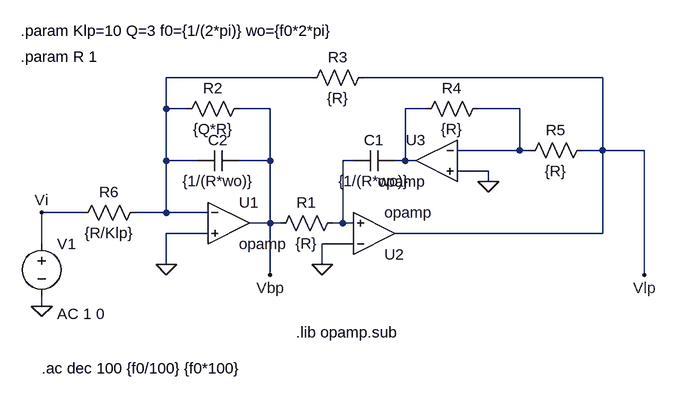
[diagram p0: schematic ts2.asc]
ts2.asc, the LTspice schematic file:
Version 4
SHEET 1 880 680
WIRE 176 96 -48 96
WIRE 624 96 256 96
WIRE -48 144 -48 96
WIRE -16 144 -48 144
WIRE 112 144 64 144
WIRE 352 144 320 144
WIRE 496 144 432 144
WIRE 496 208 496 144
WIRE 496 208 400 208
WIRE 512 208 496 208
WIRE 624 208 624 96
WIRE 624 208 592 208
WIRE 688 208 624 208
WIRE -48 224 -48 144
WIRE 0 224 -48 224
WIRE 112 224 112 144
WIRE 112 224 64 224
WIRE 240 224 224 224
WIRE 320 224 320 144
WIRE 320 224 304 224
WIRE 336 224 320 224
WIRE 448 240 400 240
WIRE 448 256 448 240
WIRE -176 304 -240 304
WIRE -48 304 -48 224
WIRE -48 304 -96 304
WIRE 16 304 -48 304
WIRE 112 320 112 224
WIRE 112 320 80 320
WIRE 128 320 112 320
WIRE 224 320 224 224
WIRE 224 320 208 320
WIRE 240 320 224 320
WIRE 16 336 -48 336
WIRE 624 336 624 208
WIRE 624 336 304 336
WIRE -240 352 -240 304
WIRE 240 352 192 352
WIRE -48 384 -48 336
WIRE 192 384 192 352
WIRE 112 400 112 320
WIRE 688 400 688 208
WIRE -240 448 -240 432
FLAG 448 256 0
FLAG -240 448 0
FLAG -48 384 0
FLAG 192 384 0
FLAG -240 304 Vi
FLAG 112 400 Vbp
FLAG 688 400 Vlp
SYMBOL OpAmps\\opamp 48 256 R0
SYMATTR InstName U1
SYMBOL OpAmps\\opamp 272 400 M180
SYMATTR InstName U2
SYMBOL res 224 304 R90
WINDOW 0 0 56 VBottom 2
WINDOW 3 32 56 VTop 2
SYMATTR InstName R1
SYMATTR Value {R}
SYMBOL OpAmps\\opamp 368 160 M0
SYMATTR InstName U3
SYMBOL cap 304 208 R90
WINDOW 0 0 32 VBottom 2
WINDOW 3 32 32 VTop 2
SYMATTR InstName C1
SYMATTR Value {1/(R*wo)}
SYMBOL voltage -240 336 R0
WINDOW 123 24 124 Left 2
WINDOW 39 0 0 Left 0
SYMATTR Value2 AC 1 0
SYMATTR InstName V1
SYMATTR Value ""
SYMBOL cap 64 208 R90
WINDOW 0 0 32 VBottom 2
WINDOW 3 32 32 VTop 2
SYMATTR InstName C2
SYMATTR Value {1/(R*wo)}
SYMBOL res 80 128 R90
WINDOW 0 0 56 VBottom 2
WINDOW 3 32 56 VTop 2
SYMATTR InstName R2
SYMATTR Value {Q*R}
SYMBOL res 272 80 R90
WINDOW 0 0 56 VBottom 2
WINDOW 3 32 56 VTop 2
SYMATTR InstName R3
SYMATTR Value {R}
SYMBOL res 448 128 R90
WINDOW 0 0 56 VBottom 2
WINDOW 3 32 56 VTop 2
SYMATTR InstName R4
SYMATTR Value {R}
SYMBOL res 608 192 R90
WINDOW 0 0 56 VBottom 2
WINDOW 3 32 56 VTop 2
SYMATTR InstName R5
SYMATTR Value {R}
SYMBOL res -80 288 R90
WINDOW 0 0 56 VBottom 2
WINDOW 3 32 56 VTop 2
SYMATTR InstName R6
SYMATTR Value {R/Klp}
TEXT 152 488 Left 2 !.lib opamp.sub
TEXT -240 544 Left 2 !.ac dec 100 {f0/100} {f0*100}
TEXT -272 24 Left 2 !.param Klp=10 Q=3 f0={1/(2*pi)} wo={f0*2*pi}
TEXT -272 64 Left 2 !.param R 1

The netlist it stands for:
* ts2.asc
XU1 N001 0 Vbp opamp Aol=100K GBW=10Meg  ; pins invin noninvin out
XU2 0 N004 Vlp opamp Aol=100K GBW=10Meg  ; pins invin noninvin out
R1 N004 Vbp {R}
XU3 N003 0 N002 opamp Aol=100K GBW=10Meg  ; pins invin noninvin out
C1 N002 N004 {1/(R*wo)}
V1 Vi 0 AC 1 0
C2 Vbp N001 {1/(R*wo)}
R2 Vbp N001 {Q*R}
R3 Vlp N001 {R}
R4 N003 N002 {R}
R5 Vlp N003 {R}
R6 N001 Vi {R/Klp}
.lib opamp.sub
.ac dec 100 {f0/100} {f0*100}
.param Klp=10 Q=3 f0={1/(2*pi)} wo={f0*2*pi}
.param R 1
.backanno
.end

* Results of the author's LTspice run, read from the files saved beside the schematic
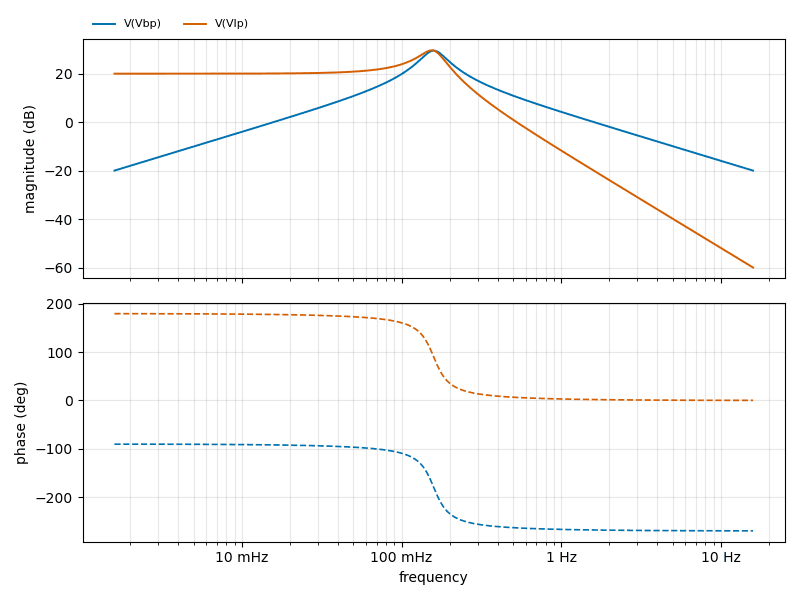
[diagram p1: AC Analysis of ts2.asc, plotted from the saved traces]
* AC Analysis, 1 run:
*   V(Vbp): -20.00 dB at 1.592 mHz, -20.00 dB at 15.92 Hz, peak 29.53 dB at 159.2 mHz, 3 dB below the peak at 134.8 mHz and 187.9 mHz
*   V(Vlp): 20.00 dB at 1.592 mHz, -60.00 dB at 15.92 Hz, peak 29.65 dB at 155.5 mHz, 3 dB below the peak at 124.8 mHz and 179.6 mHz